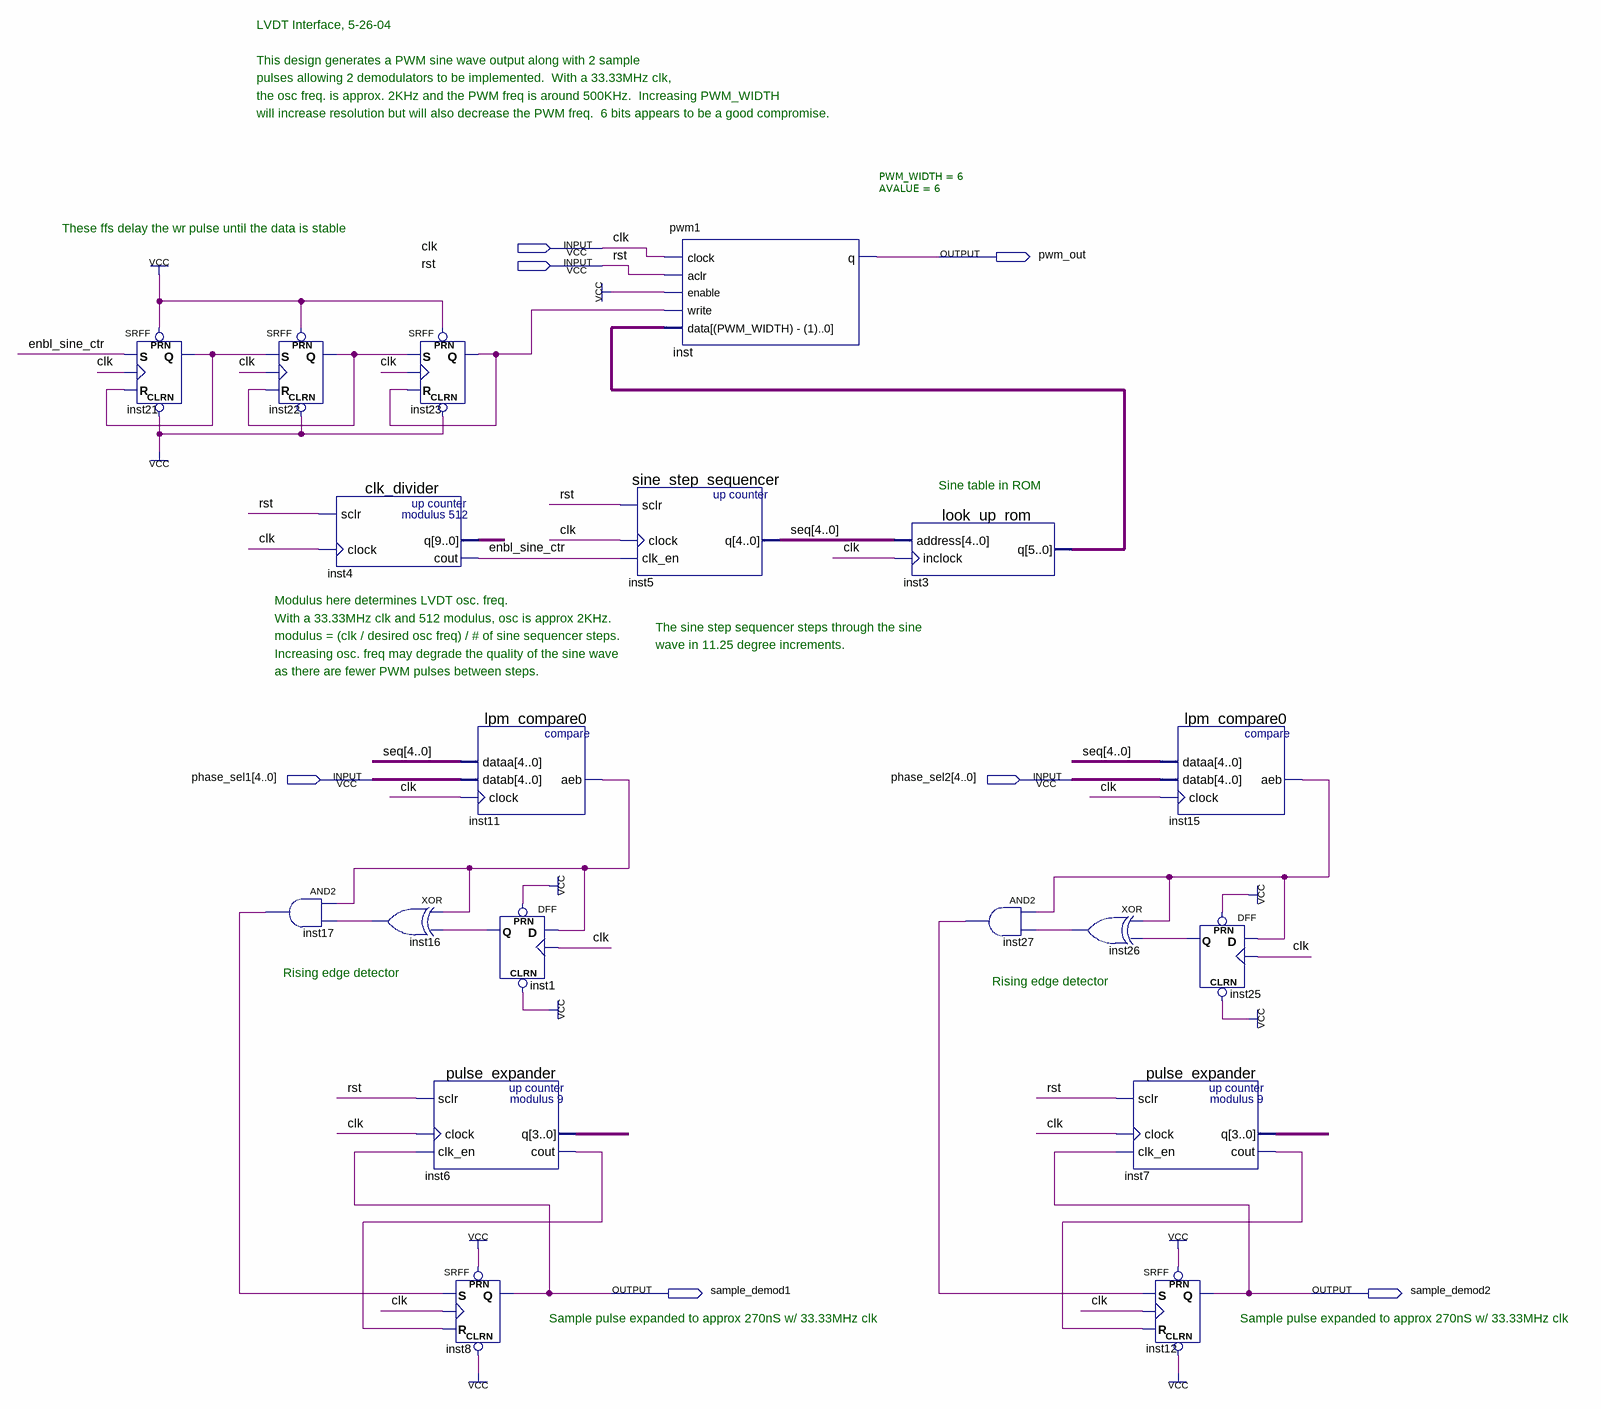
[diagram p0: schematic sheet]
// Quartus schematic lvdt_interface_orig.bdf as structural Verilog: 19 symbols, 7 pins
module lvdt_interface_orig (
  input  clk,
  input  rst,
  input  [4:0] phase_sel1,
  input  [4:0] phase_sel2,
  output pwm_out,
  output sample_demod1,
  output sample_demod2
);

  wire enbl_sine_ctr, inst1_q, inst6_cout, inst7_cout, inst11_aeb, inst15_aeb, inst16_out, inst17_out,
       inst21_q, inst22_q, inst23_q, inst25_q, inst26_out, inst27_out;
  wire [3:0] inst6_q, inst7_q;
  wire [4:0] seq;
  wire [5:0] inst3_q;
  wire [9:0] inst4_q;

  SRFF inst21 (.PRN(1'b1), .CLRN(1'b1), .S(enbl_sine_ctr), .R(inst21_q), .CLK(clk), .Q(inst21_q));
  SRFF inst22 (.PRN(1'b1), .CLRN(1'b1), .S(inst21_q), .R(inst22_q), .CLK(clk), .Q(inst22_q));
  and inst17 (inst17_out, inst11_aeb, inst16_out);
  clk_divider inst4 (.sclr(rst), .clock(clk), .q(inst4_q), .cout(enbl_sine_ctr));
  SRFF inst23 (.PRN(1'b1), .CLRN(1'b1), .S(inst22_q), .R(inst23_q), .CLK(clk), .Q(inst23_q));
  xor inst16 (inst16_out, inst11_aeb, inst1_q);
  lpm_compare0 inst11 (.dataa(seq), .datab(phase_sel1), .clock(clk), .aeb(inst11_aeb));
  pulse_expander inst6 (.sclr(rst), .clock(clk), .clk_en(sample_demod1), .q(inst6_q), .cout(inst6_cout));
  SRFF inst8 (.PRN(1'b1), .CLRN(1'b1), .S(inst17_out), .R(inst6_cout), .CLK(clk), .Q(sample_demod1));
  DFF inst1 (.CLRN(1'b1), .CLK(clk), .D(inst11_aeb), .PRN(1'b1), .Q(inst1_q));
  sine_step_sequencer inst5 (.sclr(rst), .clock(clk), .clk_en(enbl_sine_ctr), .q(seq));
  pwm1 #(.PWM_WIDTH(6), .AVALUE(6)) inst (
    .clock(clk), .aclr(rst), .enable(1'b1), .write(inst23_q), .data(inst3_q), .q(pwm_out));
  look_up_rom inst3 (.address(seq), .inclock(clk), .q(inst3_q));
  and inst27 (inst27_out, inst15_aeb, inst26_out);
  xor inst26 (inst26_out, inst15_aeb, inst25_q);
  pulse_expander inst7 (.sclr(rst), .clock(clk), .clk_en(sample_demod2), .q(inst7_q), .cout(inst7_cout));
  lpm_compare0 inst15 (.dataa(seq), .datab(phase_sel2), .clock(clk), .aeb(inst15_aeb));
  DFF inst25 (.CLRN(1'b1), .CLK(clk), .D(inst15_aeb), .PRN(1'b1), .Q(inst25_q));
  SRFF inst12 (.PRN(1'b1), .CLRN(1'b1), .S(inst27_out), .R(inst7_cout), .CLK(clk), .Q(sample_demod2));

  // Notes on the sheet:
  //   LVDT Interface, 5-26-04
  //   This design generates a PWM sine wave output along with 2 sample
  //   pulses allowing 2 demodulators to be implemented.  With a 33.33MHz clk,
  //   the osc freq. is approx. 2KHz and the PWM freq is around 500KHz.  Increasing PWM_WIDTH
  //   will increase resolution but will also decrease the PWM freq.  6 bits appears to be a good compromise.
  //   These ffs delay the wr pulse until the data is stable
  //   Sine table in ROM
  //   Modulus here determines LVDT osc. freq.
  //   With a 33.33MHz clk and 512 modulus, osc is approx 2KHz.
  //   The sine step sequencer steps through the sine
  //   modulus = (clk / desired osc freq) / # of sine sequencer steps.
  //   wave in 11.25 degree increments.
  //   Increasing osc. freq may degrade the quality of the sine wave
  //   as there are fewer PWM pulses between steps.
  //   Rising edge detector
  //   Rising edge detector
  //   Sample pulse expanded to approx 270nS w/ 33.33MHz clk
  //   Sample pulse expanded to approx 270nS w/ 33.33MHz clk
endmodule
